# Altium project BIME Final PCB.PrjPcb
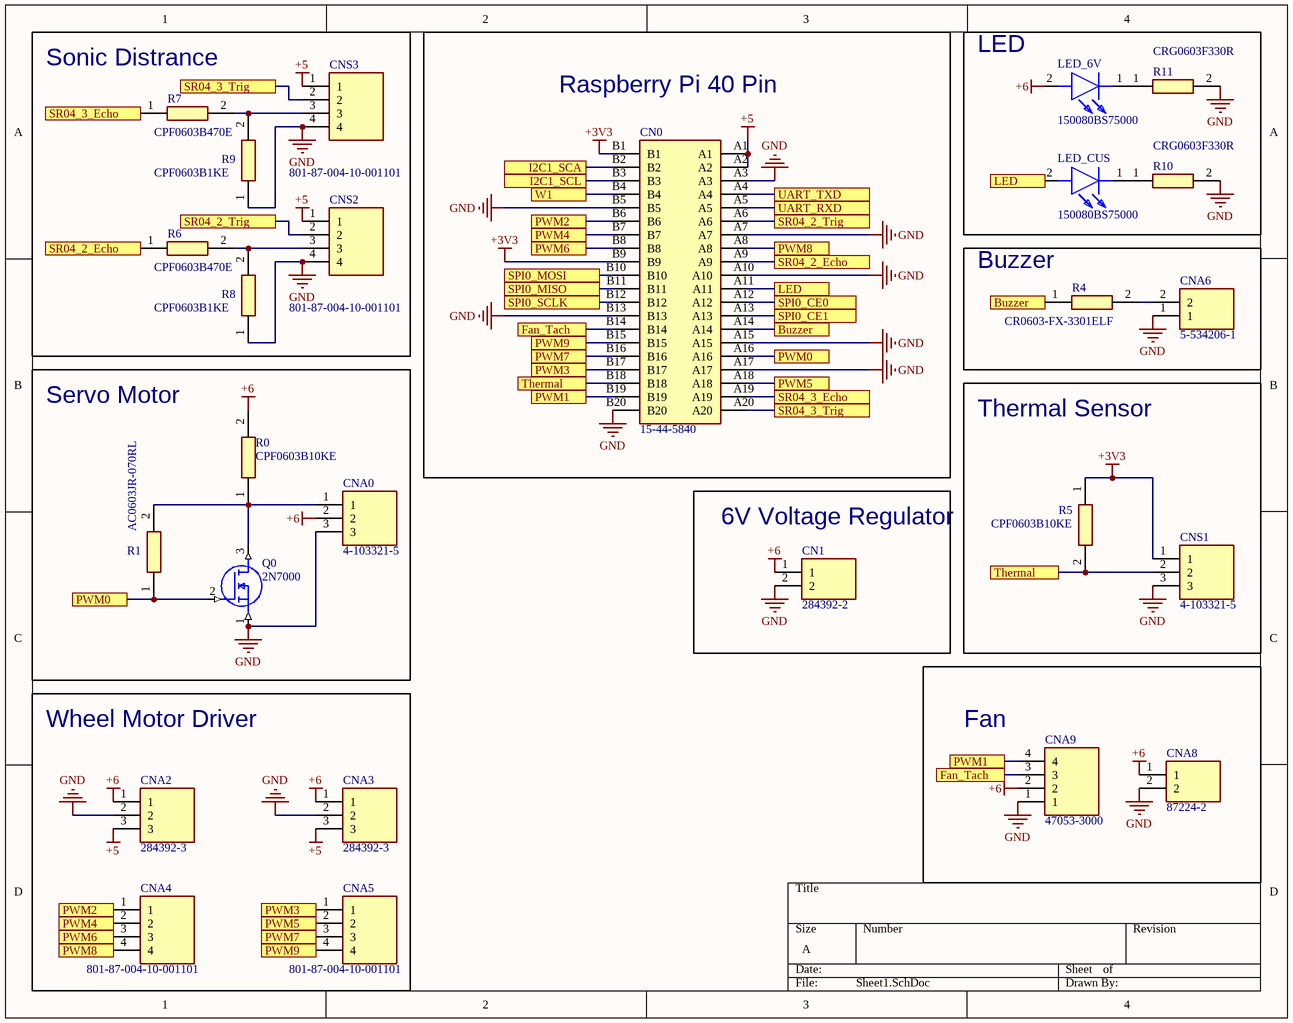
[diagram p0: Sheet1.SchDoc]
1 sheet, 26 parts. Net scope: flat (ports and power ports of the same name join across sheets).
Board file: PCB1.PcbDoc

## Sheet Sheet1.SchDoc
size A

### Parts
CN0  15-44-5840  [15445840]
CN1  284392-2  [2843922]
CNA0  4-103321-5  [HDRV3W69P0X254_1X3_721X234X1036P]
CNA2  284392-3  [2843923]
CNA3  284392-3  [2843923]
CNA4  801-87-004-10-001101  [RHDR4W60P0X254_1X4_1016X254X700P]
CNA5  801-87-004-10-001101  [RHDR4W60P0X254_1X4_1016X254X700P]
CNA6  5-534206-1  [55342061]
CNA8  87224-2  [872242]
CNA9  47053-3000  [470533000]
CNS1  4-103321-5  [HDRV3W69P0X254_1X3_721X234X1036P]
CNS2  801-87-004-10-001101  [RHDR4W60P0X254_1X4_1016X254X700P]
CNS3  801-87-004-10-001101  [RHDR4W60P0X254_1X4_1016X254X700P]
LED_6V  150080BS75000  [LEDC2012X80N]
LED_CUS  150080BS75000  [LEDC2012X80N]
Q0  2N7000  [TO-92_(TO-226)]
R0  CPF0603B10KE  [RESC1608X55N]
R1  AC0603JR-070RL  [RESC1608X55N]
R4  CR0603-FX-3301ELF  [RESC1608X55N]
R5  CPF0603B10KE  [RESC1608X55N]
R6  CPF0603B470E  [RESC1608X55N]
R7  CPF0603B470E  [RESC1608X55N]
R8  CPF0603B1KE  [RESC1608X55N]
R9  CPF0603B1KE  [RESC1608X55N]
R10  CRG0603F330R  [RESC1608X55N]
R11  CRG0603F330R  [RESC1608X55N]

### Blocks framed on the sheet
Sonic Distrance: CNS2 CNS3 R6-R9
Raspberry Pi 40 Pin: CN0
LED: LED_6V LED_CUS R10 R11
Buzzer: CNA6 R4
Servo Motor: CNA0 Q0 R0 R1
Thermal Sensor: CNS1 R5
6V Voltage Regulator: CN1
Wheel Motor Driver: CNA2-CNA5
Fan: CNA8 CNA9

### Ports
Buzzer, Fan_Tach, I2C1_SCA, I2C1_SCL, LED, PWM0, PWM1, PWM2, PWM3, PWM4, PWM5, PWM6, PWM7, PWM8, PWM9, SPI0_CE0, SPI0_CE1, SPI0_MISO, SPI0_MOSI, SPI0_SCLK, SR04_2_Echo, SR04_2_Trig, SR04_3_Echo, SR04_3_Trig, Thermal, UART_RXD, UART_TXD, W1

### Nets
+3V3: CN0.B1 CN0.B9 CNS1.1 R5.1
+5: CN0.A1 CN0.A2 CNA2.3 CNA3.3 CNS2.1 CNS3.1
+6: CN1.1 CNA0.2 CNA2.1 CNA3.1 CNA8.1 CNA9.2 LED_6V.2(A) R0.2
GND: CN0.A3 CN0.A7 CN0.A10 CN0.A15 CN0.A17 CN0.B5 CN0.B13 CN0.B20 CN1.2 CNA0.3 CNA2.2 CNA3.2 CNA6.1 CNA8.2 CNA9.1 CNS1.3 CNS2.4 CNS3.4 Q0.1(S) R8.1 R9.1 R10.2 R11.2
NetCN0_A4: CN0.A4 ; port UART_TXD
NetCN0_A5: CN0.A5 ; port UART_RXD
NetCN0_A6: CN0.A6 CNS2.2 ; port SR04_2_Trig
NetCN0_A8: CN0.A8 CNA4.4 ; port PWM8
NetCN0_A9: CN0.A9 R6.1 ; port SR04_2_Echo
NetCN0_A11: CN0.A11 LED_CUS.2(A) ; port LED
NetCN0_A12: CN0.A12 ; port SPI0_CE0
NetCN0_A13: CN0.A13 ; port SPI0_CE1
NetCN0_A14: CN0.A14 R4.1 ; port Buzzer
NetCN0_A16: CN0.A16 Q0.2(G) R1.1 ; port PWM0
NetCN0_A18: CN0.A18 CNA5.2 ; port PWM5
NetCN0_A19: CN0.A19 R7.1 ; port SR04_3_Echo
NetCN0_A20: CN0.A20 CNS3.2 ; port SR04_3_Trig
NetCN0_B2: CN0.B2 ; port I2C1_SCA
NetCN0_B3: CN0.B3 ; port I2C1_SCL
NetCN0_B4: CN0.B4 ; port W1
NetCN0_B6: CN0.B6 CNA4.1 ; port PWM2
NetCN0_B7: CN0.B7 CNA4.2 ; port PWM4
NetCN0_B8: CN0.B8 CNA4.3 ; port PWM6
NetCN0_B10: CN0.B10 ; port SPI0_MOSI
NetCN0_B11: CN0.B11 ; port SPI0_MISO
NetCN0_B12: CN0.B12 ; port SPI0_SCLK
NetCN0_B14: CN0.B14 CNA9.3 ; port Fan_Tach
NetCN0_B15: CN0.B15 CNA5.4 ; port PWM9
NetCN0_B16: CN0.B16 CNA5.3 ; port PWM7
NetCN0_B17: CN0.B17 CNA5.1 ; port PWM3
NetCN0_B18: CN0.B18 CNS1.2 R5.2 ; port Thermal
NetCN0_B19: CN0.B19 CNA9.4 ; port PWM1
NetCNA0_1: CNA0.1 Q0.3(D) R0.1 R1.2
NetCNA6_2: CNA6.2 R4.2
NetCNS2_3: CNS2.3 R6.2 R8.2
NetCNS3_3: CNS3.3 R7.2 R9.2
NetLED_6V_1: LED_6V.1(K) R11.1
NetLED_CUS_1: LED_CUS.1(K) R10.1

### Library data of the parts
CN0 = 15-44-5840: Connector; Manufacturer_Name: Molex; Datasheet Link: https://www.mouser.com/datasheet/2/276/0015445840_PCB_RECEPTACLES-226955.pdf; Height: 8.77mm; Manufacturer_Part_Number: 15-44-5840; Mouser Part Number: 538-15-44-5840; Mouser Price/Stock: https://www.mouser.co.uk/ProductDetail/Molex/15-44-5840?qs=uJX40y%252BSWqi3g3Sr8cjqpQ%3D%3D
CN1 = 284392-2: Connector; Manufacturer_Name: TE Connectivity; Datasheet Link: https://www.te.com/commerce/DocumentDelivery/DDEController?Action=showdoc&DocId=Customer+Drawing%7F284392%7FC%7Fpdf%7FEnglish%7FENG_CD_284392_C.pdf%7F284392-2; Height: 12.8mm; Manufacturer_Part_Number: 284392-2; Mouser Part Number: 571-284392-2; Mouser Price/Stock: https://www.mouser.co.uk/ProductDetail/TE-Connectivity/284392-2?qs=79dOc3%2F91%2FeqoQScc1vzQg%3D%3D; Arrow Part Number: 284392-2; Arrow Price/Stock: https://www.arrow.com/en/products/284392-2/te-connectivity?region=nac
CNA0 CNS1 = 4-103321-5: Connector; Manufacturer_Name: TE Connectivity; Datasheet Link: https://www.arrow.com/en/products/4-103321-5/te-connectivity; Height: 10.363mm; Manufacturer_Part_Number: 4-103321-5; Mouser Part Number: 571-4-103321-5; Mouser Price/Stock: https://www.mouser.co.uk/ProductDetail/TE-Connectivity/4-103321-5?qs=5TwgZeq9E7HSYLqaljJYrw%3D%3D; Arrow Part Number: 4-103321-5; Arrow Price/Stock: https://www.arrow.com/en/products/4-103321-5/te-connectivity?region=nac
CNA2 CNA3 = 284392-3: Connector; Manufacturer_Name: TE Connectivity; Datasheet Link: https://www.te.com/commerce/DocumentDelivery/DDEController?Action=srchrtrv&DocNm=1-1773458-1_EURO_STYLE_QRG&DocType=Data+Sheet&DocLang=English&PartCntxt=284392-3&DocFormat=pdf; Height: 12.8mm; Manufacturer_Part_Number: 284392-3; Mouser Part Number: 571-284392-3; Mouser Price/Stock: https://www.mouser.co.uk/ProductDetail/TE-Connectivity/284392-3?qs=79dOc3%2F91%2FccaCLojhwxSQ%3D%3D; Arrow Part Number: 284392-3; Arrow Price/Stock: https://www.arrow.com/en/products/284392-3/te-connectivity?region=nac
CNA4 CNA5 CNS2 CNS3 = 801-87-004-10-001101: Connector; Manufacturer_Name: Preci-Dip; Datasheet Link: https://componentsearchengine.com/Datasheets/2/801-87-004-10-001101.pdf; Height: 7mm; Manufacturer_Part_Number: 801-87-004-10-001101; Mouser Part Number: 437-8018700410001101; Mouser Price/Stock: https://www.mouser.co.uk/ProductDetail/Preci-dip/801-87-004-10-001101?qs=uQD7XCvsSCN90X3kfh7Tjg%3D%3D; Arrow Part Number: 801-87-004-10-001101; Arrow Price/Stock: https://www.arrow.com/en/products/801-87-004-10-001101/preci-dip-sa
CNA6 = 5-534206-1: Connector; Manufacturer_Name: TE Connectivity; Datasheet Link: https://componentsearchengine.com/Datasheets/2/5-534206-1.pdf; Height: 8.64mm; Manufacturer_Part_Number: 5-534206-1; Mouser Part Number: 571-5-534206-1; Mouser Price/Stock: https://www.mouser.co.uk/ProductDetail/TE-Connectivity/5-534206-1?qs=UFWaXWs7iImlMkxWCfgYww%3D%3D; Arrow Part Number: 5-534206-1; Arrow Price/Stock: https://www.arrow.com/en/products/5-534206-1/te-connectivity?region=nac
CNA8 = 87224-2: Connector; Manufacturer_Name: TE Connectivity; Datasheet Link: https://datasheet.datasheetarchive.com/originals/distributors/Datasheets_SAMA/3b9b08c08f06dc562fe3ba32b60fa864.pdf; Height: 10.3632mm; Manufacturer_Part_Number: 87224-2; Mouser Part Number: 571-872242; Mouser Price/Stock: https://www.mouser.co.uk/ProductDetail/TE-Connectivity/87224-2?qs=ZDXmSm13591yVHBRfmL3UQ%3D%3D; Arrow Part Number: 87224-2; Arrow Price/Stock: https://www.arrow.com/en/products/87224-2/te-connectivity?region=europe
CNA9 = 47053-3000: Connector; Manufacturer_Name: Molex; Datasheet Link: https://www.mouser.com/datasheet/2/276/0470533000_PCB_HEADERS-146177.pdf; Height: 9.84mm; Manufacturer_Part_Number: 47053-3000; Mouser Part Number: 538-47053-3000; Mouser Price/Stock: https://www.mouser.co.uk/ProductDetail/Molex/47053-3000?qs=C09bn3Oxp5WWv2npicpAUw%3D%3D
LED_6V LED_CUS = 150080BS75000: LED; Manufacturer_Name: Wurth Elektronik; Datasheet Link: https://katalog.we-online.com/led/datasheet/150080BS75000.pdf; Height: 0.8mm; Manufacturer_Part_Number: 150080BS75000; Mouser Part Number: 710-150080BS75000; Mouser Price/Stock: https://www.mouser.co.uk/ProductDetail/Wurth-Elektronik/150080BS75000?qs=2kOmHSv6VfT2tBo3UPVqAQ%3D%3D
Q0 = 2N7000: MOSFET (N-Channel); Manufacturer_Name: onsemi; Datasheet Link: http://www.onsemi.com/pub/Collateral/NDS7002A-D.PDF; Height: 5.33mm; Manufacturer_Part_Number: 2N7000; Mouser Part Number: 512-2N7000; Mouser Price/Stock: https://www.mouser.co.uk/ProductDetail/ON-Semiconductor-Fairchild/2N7000?qs=FOlmdCx%252BAA2o%2FKZOTk%2F3hg%3D%3D; Arrow Part Number: 2N7000; Arrow Price/Stock: https://www.arrow.com/en/products/2n7000/on-semiconductor?region=nac
R0 R5 = CPF0603B10KE: Resistor; Manufacturer_Name: TE Connectivity; Datasheet Link: http://www.farnell.com/datasheets/1786775.pdf; Height: 0.55mm; Manufacturer_Part_Number: CPF0603B10KE; Mouser Part Number: 279-CPF0603B10KE; Mouser Price/Stock: https://www.mouser.co.uk/ProductDetail/TE-Connectivity-Holsworthy/CPF0603B10KE?qs=DfH2yQaBz6sBU3bWyKu9NQ%3D%3D; Arrow Part Number: CPF0603B10KE; Arrow Price/Stock: https://www.arrow.com/en/products/cpf0603b10ke/te-connectivity?region=nac
R1 = AC0603JR-070RL: Resistor; Manufacturer_Name: KEMET; Datasheet Link: https://componentsearchengine.com/Datasheets/2/AC0603JR-070RL.pdf; Height: 0.55mm; Manufacturer_Part_Number: AC0603JR-070RL; Mouser Part Number: 603-AC0603JR-070RL; Mouser Price/Stock: https://www.mouser.co.uk/ProductDetail/Yageo/AC0603JR-070RL?qs=cGU37fGUGy%252BRlrkivEI2Lg%3D%3D; Arrow Part Number: AC0603JR-070RL; Arrow Price/Stock: https://www.arrow.com/en/products/ac0603jr-070rl/yageo
R4 = CR0603-FX-3301ELF: Resistor; Manufacturer_Name: Bourns; Datasheet Link: https://www.bourns.com/pdfs/chpreztr.pdf; Height: 0.55mm; Manufacturer_Part_Number: CR0603-FX-3301ELF; Mouser Part Number: 652-CR0603-FX3301ELF; Mouser Price/Stock: https://www.mouser.co.uk/ProductDetail/Bourns/CR0603-FX-3301ELF?qs=I4suiNu8FYAeN75YxKNWXA%3D%3D; Arrow Part Number: CR0603-FX-3301ELF; Arrow Price/Stock: https://www.arrow.com/en/products/cr0603-fx-3301elf/bourns
R6 R7 = CPF0603B470KE: Resistor; Manufacturer_Name: TE Connectivity; Datasheet Link: http://www.farnell.com/datasheets/1786775.pdf; Height: 0.55mm; Manufacturer_Part_Number: CPF0603B470KE; Mouser Part Number: 279-CPF0603B470KE; Mouser Price/Stock: https://www.mouser.co.uk/ProductDetail/TE-Connectivity-Neohm/CPF0603B470KE?qs=gt1LBUVyoHmzllBO311l3A%3D%3D
R8 R9 = CPF0603B10RE1: Resistor; Manufacturer_Name: TE Connectivity; Datasheet Link: http://www.farnell.com/datasheets/1786775.pdf; Height: 0.55mm; Manufacturer_Part_Number: CPF0603B10RE1; Mouser Part Number: 279-CPF0603B10RE1; Mouser Price/Stock: https://www.mouser.co.uk/ProductDetail/TE-Connectivity-Holsworthy/CPF0603B10RE1?qs=8H%2F0gMnrDruueUSujn28yg%3D%3D; Arrow Part Number: CPF0603B10RE1; Arrow Price/Stock: https://www.arrow.com/en/products/cpf0603b10re1/te-connectivity
R10 R11 = CRG0603F330R: Resistor; Manufacturer_Name: TE Connectivity; Datasheet Link: https://datasheet.datasheetarchive.com/originals/distributors/DKDS-21/401698.pdf; Height: 0.55mm; Manufacturer_Part_Number: CRG0603F330R; Mouser Part Number: 279-CRG0603F330R; Mouser Price/Stock: https://www.mouser.co.uk/ProductDetail/TE-Connectivity-Neohm/CRG0603F330R?qs=VHcS2MTj4gbwoBQCSa%252B2DQ%3D%3D; Arrow Part Number: CRG0603F330R; Arrow Price/Stock: https://www.arrow.com/en/products/crg0603f330r/te-connectivity